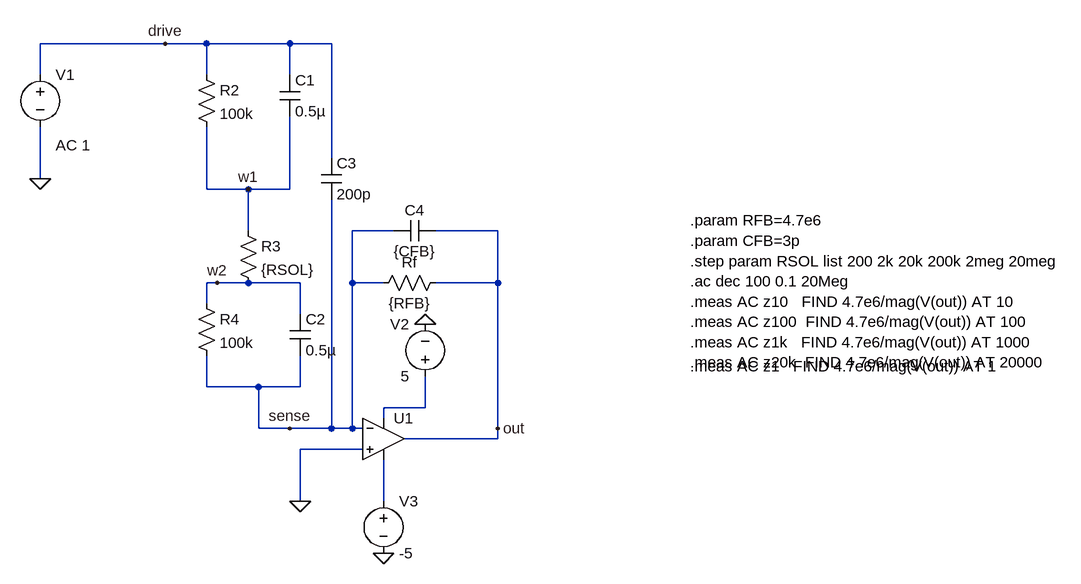
[diagram p0: schematic probe_circuit.asc]
probe_circuit.asc, the LTspice schematic file:
Version 4.1
SHEET 1 1728 836
WIRE 304 32 112 32
WIRE 368 32 304 32
WIRE 496 32 368 32
WIRE 560 32 496 32
WIRE 112 80 112 32
WIRE 368 80 368 32
WIRE 496 80 496 32
WIRE 560 208 560 32
WIRE 112 240 112 160
WIRE 368 256 368 160
WIRE 432 256 368 256
WIRE 496 256 496 144
WIRE 496 256 432 256
WIRE 432 320 432 256
WIRE 656 320 592 320
WIRE 816 320 720 320
WIRE 384 400 368 400
WIRE 432 400 384 400
WIRE 512 400 432 400
WIRE 592 400 592 320
WIRE 640 400 592 400
WIRE 816 400 816 320
WIRE 816 400 720 400
WIRE 368 432 368 400
WIRE 512 448 512 400
WIRE 368 560 368 512
WIRE 448 560 368 560
WIRE 512 560 512 512
WIRE 512 560 448 560
WIRE 704 592 704 544
WIRE 704 592 640 592
WIRE 640 608 640 592
WIRE 448 624 448 560
WIRE 496 624 448 624
WIRE 560 624 560 272
WIRE 560 624 496 624
WIRE 592 624 592 400
WIRE 592 624 560 624
WIRE 608 624 592 624
WIRE 816 624 816 400
WIRE 816 640 816 624
WIRE 816 640 672 640
WIRE 608 656 512 656
WIRE 512 736 512 656
WIRE 640 736 640 672
FLAG 304 32 drive
FLAG 432 256 w1
FLAG 384 400 w2
FLAG 704 464 0
FLAG 640 816 0
FLAG 512 736 0
FLAG 112 240 0
FLAG 496 624 sense
FLAG 816 624 out
DATAFLAG 816 528 ""
SYMBOL voltage 112 64 R0
WINDOW 123 24 124 Left 2
WINDOW 39 0 0 Left 0
SYMATTR Value2 AC 1
SYMATTR InstName V1
SYMATTR Value ""
SYMBOL res 352 64 R0
SYMATTR InstName R2
SYMATTR Value 100k
SYMBOL cap 480 80 R0
SYMATTR InstName C1
SYMATTR Value 0.5µ
SYMBOL res 416 304 R0
SYMATTR InstName R3
SYMATTR Value {RSOL}
SYMBOL res 352 416 R0
SYMATTR InstName R4
SYMATTR Value 100k
SYMBOL cap 496 448 R0
SYMATTR InstName C2
SYMATTR Value 0.5µ
SYMBOL OpAmps\\UniversalOpAmp2 640 640 R0
SYMATTR InstName U1
SYMBOL voltage 704 560 R180
WINDOW 0 24 96 Left 2
WINDOW 3 24 16 Left 2
WINDOW 123 0 0 Left 0
WINDOW 39 0 0 Left 0
SYMATTR InstName V2
SYMATTR Value 5
SYMBOL voltage 640 720 R0
WINDOW 123 0 0 Left 0
WINDOW 39 0 0 Left 0
SYMATTR InstName V3
SYMATTR Value -5
SYMBOL res 736 384 R90
WINDOW 0 0 56 VBottom 2
WINDOW 3 32 56 VTop 2
SYMATTR InstName Rf
SYMATTR Value {RFB}
SYMBOL cap 544 208 R0
SYMATTR InstName C3
SYMATTR Value 200p
SYMBOL cap 720 304 R90
WINDOW 0 0 32 VBottom 2
WINDOW 3 32 32 VTop 2
SYMATTR InstName C4
SYMATTR Value {CFB}
TEXT 1112 304 Left 2 !.param RFB=4.7e6\n.param CFB=3p\n.step param RSOL list 200 2k 20k 200k 2meg 20meg\n.ac dec 100 0.1 20Meg\n.meas AC z10   FIND 4.7e6/mag(V(out)) AT 10\n.meas AC z100  FIND 4.7e6/mag(V(out)) AT 100\n.meas AC z1k   FIND 4.7e6/mag(V(out)) AT 1000\n.meas AC z20k  FIND 4.7e6/mag(V(out)) AT 20000
TEXT 1112 528 Left 2 !.meas AC z1   FIND 4.7e6/mag(V(out)) AT 1

The netlist it stands for:
* probe_circuit.asc
V1 drive 0 AC 1
R2 drive w1 100k
C1 drive w1 0.5µ
R3 w1 w2 {RSOL}
R4 w2 sense 100k
C2 w2 sense 0.5µ
X§U1 0 sense N001 N002 out level2 Avol=1Meg GBW=10Meg Slew=10Meg Ilimit=25m Rail=0 Vos=0 En=0 Enk=0 In=0 Ink=0 Rin=500Meg  ; pins In+ In- V+ V- OUT
V2 N001 0 5
V3 N002 0 -5
Rf out sense {RFB}
C3 drive sense 200p
C4 out sense {CFB}
.param RFB=4.7e6
.param CFB=3p
.step param RSOL list 200 2k 20k 200k 2meg 20meg
.ac dec 100 0.1 20Meg
.meas AC z10   FIND 4.7e6/mag(V(out)) AT 10
.meas AC z100  FIND 4.7e6/mag(V(out)) AT 100
.meas AC z1k   FIND 4.7e6/mag(V(out)) AT 1000
.meas AC z20k  FIND 4.7e6/mag(V(out)) AT 20000
.meas AC z1   FIND 4.7e6/mag(V(out)) AT 1
.lib UniversalOpAmp2.lib
.backanno
.end